# Altium schematic sheet FPGA Config.SCHDOC: FPGA Rack
size 420 x 297 mm; DrawnBy: zas; Revision: V1.0; SheetNumber: 7; SheetTotal: 25; DocumentName: FPGA Config.SCHDOC
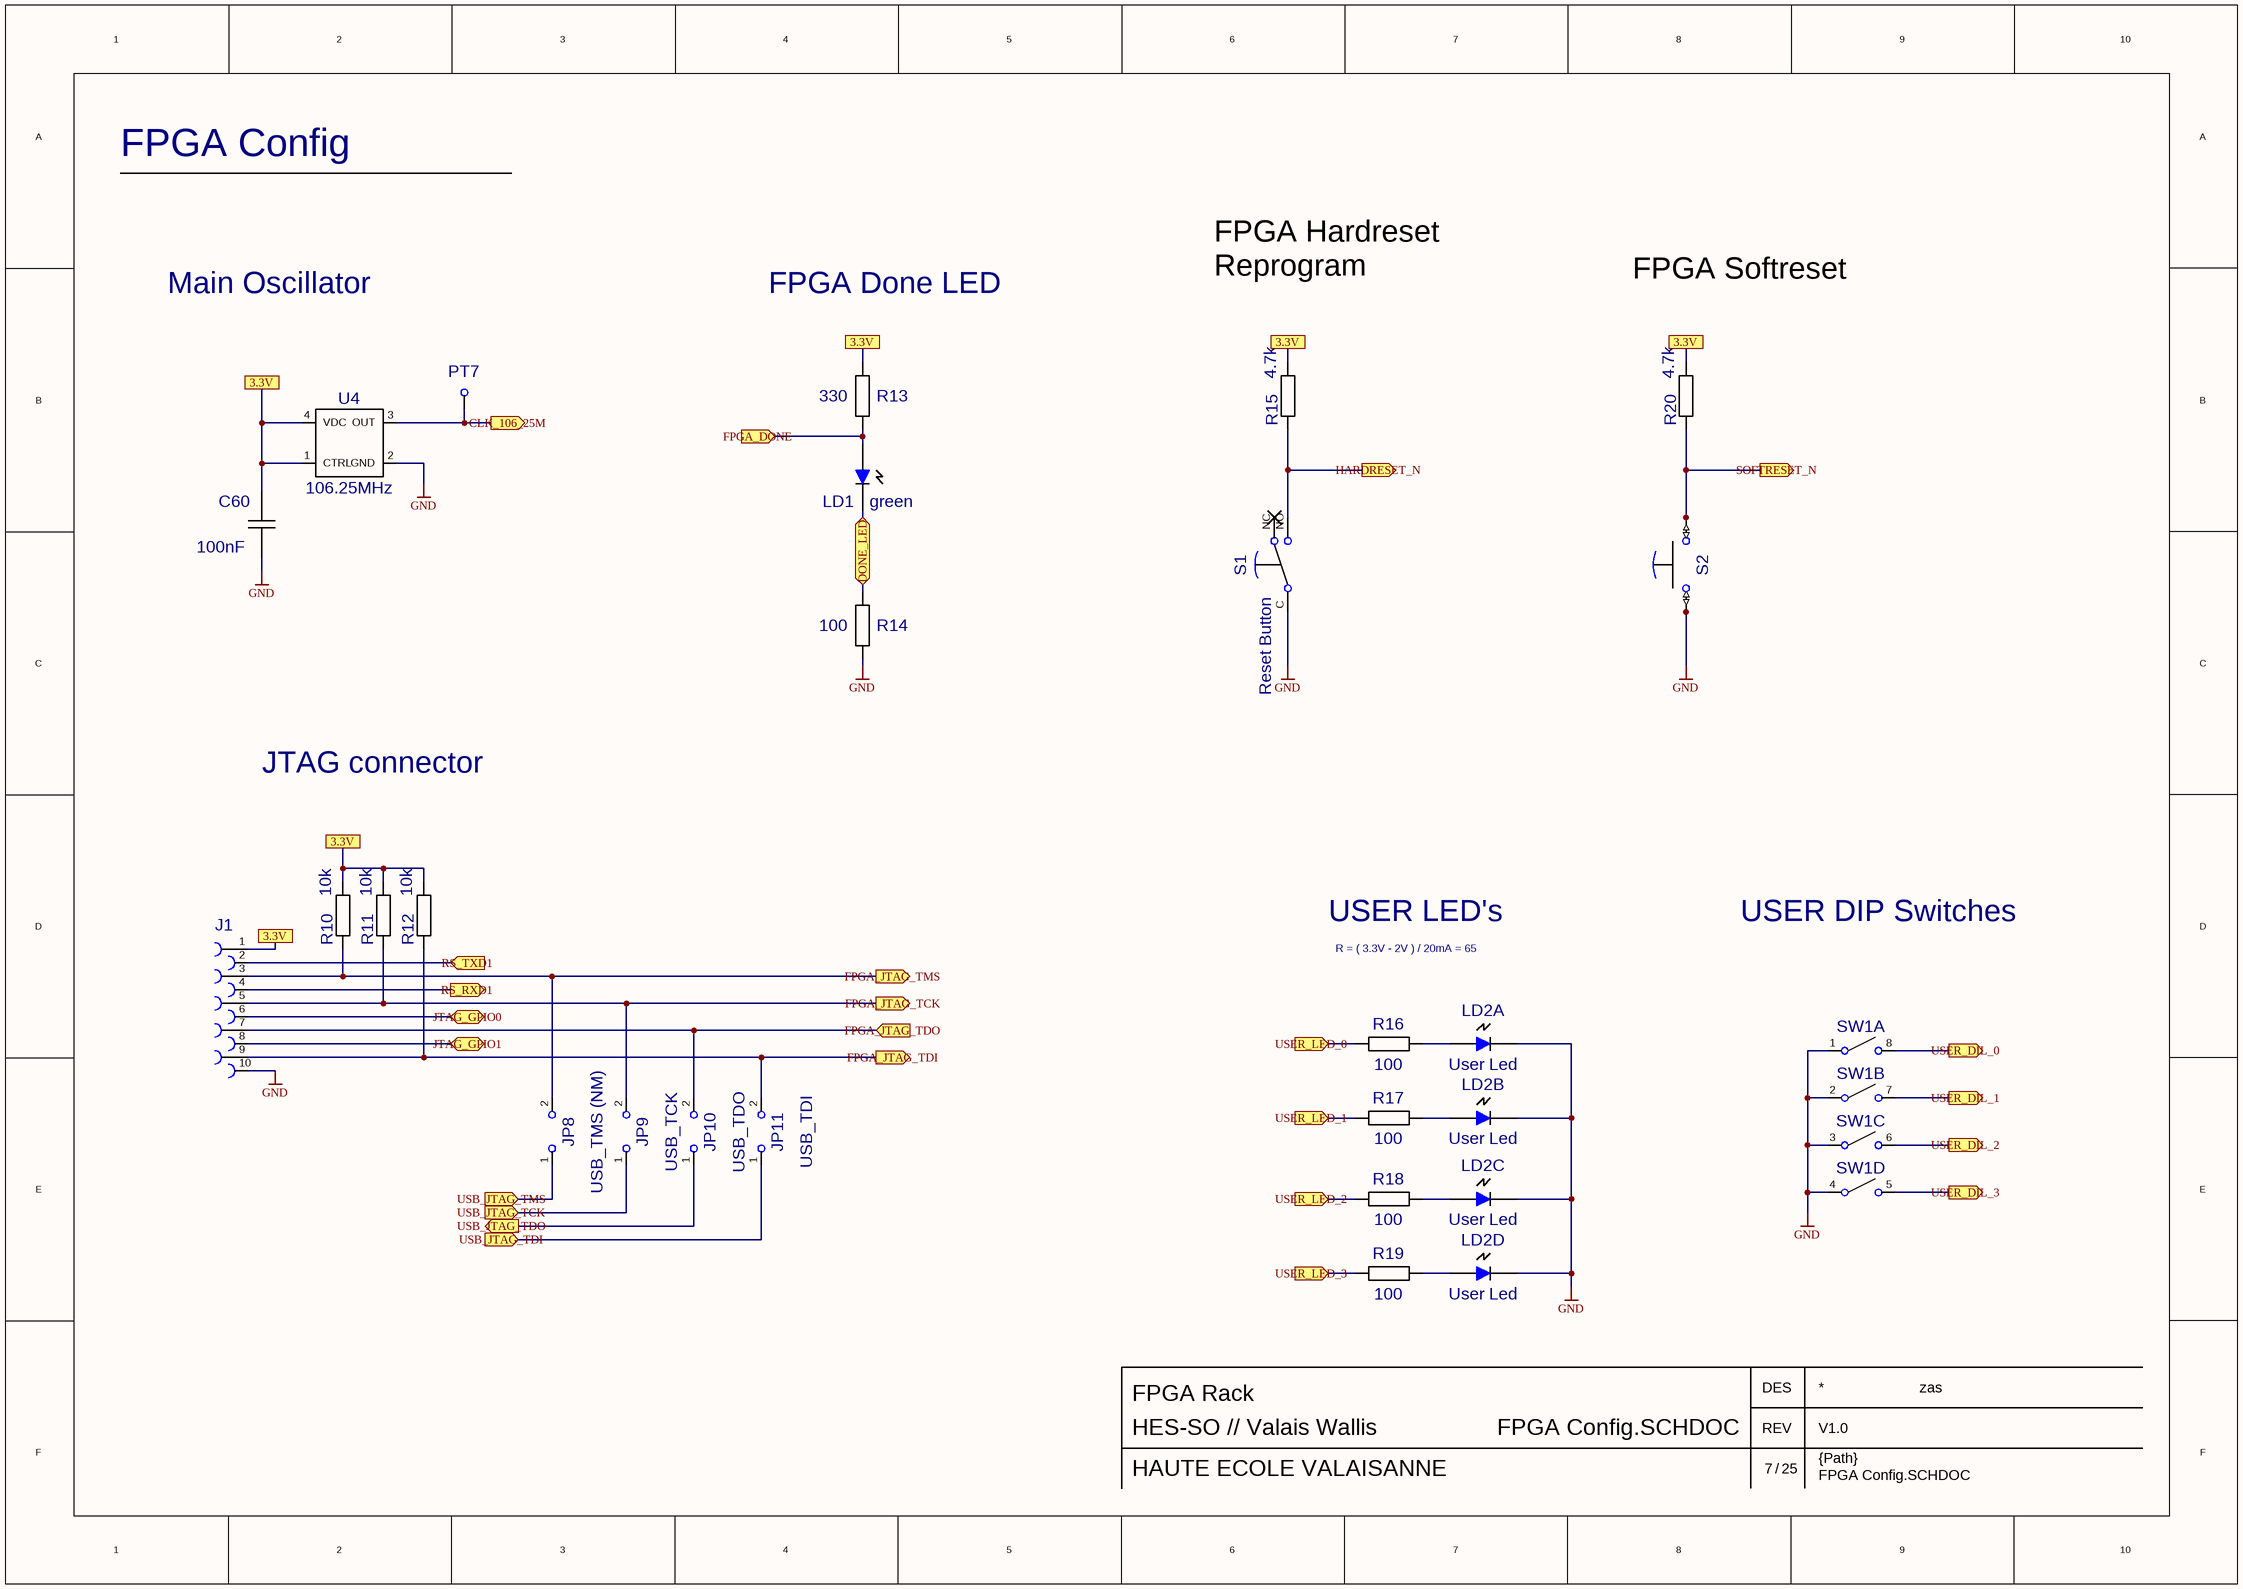
[diagram p0: FPGA Config.SCHDOC]

## Parts
C60  value 100nF  [CC0805-MM]  (hidden comment: CAPS0805-MM)
J1  CONNB2X5-2MM-COUDE  [CONN2X5-2MM-FCI-COUDE]  (value not drawn)
JP8  value USB_TMS (NM)  [JUMPER-SMD]  (hidden comment: JUMPER-SMD)
JP9  value USB_TCK  [JUMPER-SMD]  (hidden comment: JUMPER-SMD)
JP10  value USB_TDO  [JUMPER-SMD]  (hidden comment: JUMPER-SMD)
JP11  value USB_TDI  [JUMPER-SMD]  (hidden comment: JUMPER-SMD)
LD1  value green  [LED_SMD0805-MM]  (hidden comment: LED0805-MM)
LD2  value User Led  [LED-569-010X-XXX]  (hidden comment: LED-569-010X-XXX)  (parts A,B,C,D of 4)
PT7  PTEST  [CONN1X1M]  (value not drawn)
R10  value 10k  [RC0805-MM]  (hidden comment: RS0805-MM)
R11  value 10k  [RC0805-MM]  (hidden comment: RS0805-MM)
R12  value 10k  [RC0805-MM]  (hidden comment: RS0805-MM)
R13  value 330  [RC0805-MM]  (hidden comment: RS0805-MM)
R14  value 100  [RC0805-MM]  (hidden comment: RS0805-MM)
R15  value 4.7k  [RC0805-MM]  (hidden comment: RS0805-MM)
R16  value 100  [RC0805-MM]  (hidden comment: RS0805-MM)
R17  value 100  [RC0805-MM]  (hidden comment: RS0805-MM)
R18  value 100  [RC0805-MM]  (hidden comment: RS0805-MM)
R19  value 100  [RC0805-MM]  (hidden comment: RS0805-MM)
R20  value 4.7k  [RC0805-MM]  (hidden comment: RS0805-MM)
S1  value Reset Button  [PUSHBUTTON-03]  (hidden comment: PUSHBUTT-SH3-01)
S2  PUSHBUTT-DTSM  [PUSHBUTT-DTSM]  (value not drawn)
SW1  SW-CTS-193-4MS  [SW-CTS-193-4MS]  (value not drawn)  (parts A,B,C,D of 4)
U4  value 106.25MHz  [OSCILL-VX3]  (hidden comment: OSCILL-VX3)

## Ports
3.3V, CLK_106_25M (out), DONE_LED (bidir), FPGA_DONE (in), FPGA_JTAG_TCK (out), FPGA_JTAG_TDI (out), FPGA_JTAG_TDO (in), FPGA_JTAG_TMS (out), HARDRESET_N (out), JTAG_GPIO0 (bidir), JTAG_GPIO1 (bidir), RS_RXD1 (out), RS_TXD1 (in), SOFTRESET_N (out), USB_JTAG_TCK (in), USB_JTAG_TDI (in), USB_JTAG_TDO (out), USB_JTAG_TMS (in), USER_DIL_0 (out), USER_DIL_1 (out), USER_DIL_2 (out), USER_DIL_3 (out), USER_LED_0 (in), USER_LED_1 (in), USER_LED_2 (in), USER_LED_3 (in)

## Nets
GND: C60.1 J1.10 LD2.2(-) LD2.4(-) LD2.6(-) LD2.8(-) R14.2 S1.C S2.1 S2.2 SW1.1 SW1.2 SW1.3 SW1.4 U4.2(GND)
CLK_106_25M: PT7.1(A) U4.3(OUT) ; port CLK_106_25M
DONE_LED: LD1.1(K) R14.1 ; port DONE_LED
FPGA_DONE: LD1.2(A) R13.2 ; port FPGA_DONE
FPGA_JTAG_TCK: J1.5 JP9.2 R11.1 ; port FPGA_JTAG_TCK
FPGA_JTAG_TDI: J1.9 JP11.2 R12.1 ; port FPGA_JTAG_TDI
FPGA_JTAG_TDO: J1.7 JP10.2 ; port FPGA_JTAG_TDO
FPGA_JTAG_TMS: J1.3 JP8.2 R10.1 ; port FPGA_JTAG_TMS
HARDRESET_N: R15.1 S1.NO ; port HARDRESET_N
JTAG_GPIO0: J1.6 ; port JTAG_GPIO0
JTAG_GPIO1: J1.8 ; port JTAG_GPIO1
RS_RXD1: J1.4 ; port RS_RXD1
RS_TXD1: J1.2 ; port RS_TXD1
SOFTRESET_N: R20.1 S2.3 S2.4 ; port SOFTRESET_N
USB_JTAG_TCK: JP9.1 ; port USB_JTAG_TCK
USB_JTAG_TDI: JP11.1 ; port USB_JTAG_TDI
USB_JTAG_TDO: JP10.1 ; port USB_JTAG_TDO
USB_JTAG_TMS: JP8.1 ; port USB_JTAG_TMS
USER_DIL_0: SW1.8 ; port USER_DIL_0
USER_DIL_1: SW1.7 ; port USER_DIL_1
USER_DIL_2: SW1.6 ; port USER_DIL_2
USER_DIL_3: SW1.5 ; port USER_DIL_3
USER_LED_0: R16.1 ; port USER_LED_0
USER_LED_1: R17.1 ; port USER_LED_1
USER_LED_2: R18.1 ; port USER_LED_2
USER_LED_3: R19.1 ; port USER_LED_3
NetC60_2: C60.2 U4.1(CTRL) U4.4(VDC)
NetLD2_1: LD2.1(+) R16.2
NetLD2_3: LD2.3(+) R17.2
NetLD2_5: LD2.5(+) R18.2
NetLD2_7: LD2.7(+) R19.2
NetR10_2: R10.2 R11.2 R12.2

Not connected (* = marked no-connect by the designer): J1 1; R13 1; R15 2; R20 2; S1 NC

## Notes on the sheet
- FPGA Config
- Main Oscillator
- FPGA Done LED
- FPGA Hardreset
  Reprogram
- FPGA Softreset
- JTAG connector
- USER LED's
- USER DIP Switches
- R = ( 3.3V - 2V ) / 20mA = 65
- DES
- HES-SO // Valais Wallis
- HAUTE ECOLE VALAISANNE
- /
- REV
- {Path}

## Library data of the parts
C60 = CAPS0805-MM: Capacitor; Partition: Point-to-point IOs; RefDes2: {RefDes2}; MEZZAONLY: YES
JP8-JP11 = JUMPER-SMD: use: power supply 3.3
LD1 = LED0805-MM: Led smd - Stanley Distrelec N° 25 31 00
LD2 = LED-569-010X-XXX: LED Schurter - Distrelec 25 09 08...
PT7 = PTEST_VARIANT_1: Partition: Point-to-point IOs; RefDes2: {RefDes2}; MEZZAONLY: YES; Value: *
R10-R12 R15 R20 = RS0805-MM: Partition: FPGA Config; RefDes2: {RefDes2}; MEZZAONLY: YES
S1 = PUSHBUTT-SH3-01: ITW Switches JPM 1990-0101 / Distrelec 20 15 40; use: cpu reset
S2 = PUSHBUTT-DTSM: Pushbutton NO Schurter type SMS J-leads; Partition: Point-to-point IOs; Value: Button 2; RefDes2: {RefDes2}; MEZZAONLY: YES
SW1 = SW-CTS-193-4MS: Dip switch smd 4 poles - Thomas & Betts - Distrelec 21 04 21
U4 = OSCILL-VX3: Oscillator serie VX3 - Jauch - Distrelec 68 03 82 .. 68 04 00; Partition: Point-to-point IOs; RefDes2: {RefDes2}; MEZZAONLY: YES
J1 = CONNB2X5-2MM-COUDE: Value: *